# EAGLE design Interdigitated (EAGLE 9.6.2)
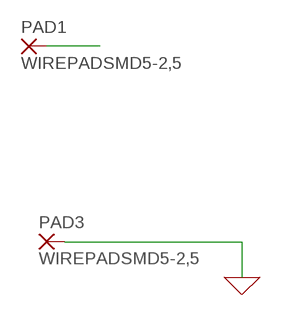
[diagram p0: schematic, sheet 1]

## Parts
PAD1  WIREPADSMD5-2,5  [5-2,5]
PAD3  WIREPADSMD5-2,5  [5-2,5]

## Nets
0: PAD3.1(P) ; supply symbol labelled GND
N$1: PAD1.1(P)

## Library data of the parts
PAD1 PAD3 = wirepad:WIREPAD: Wire PAD connect wire on PCB

## Board
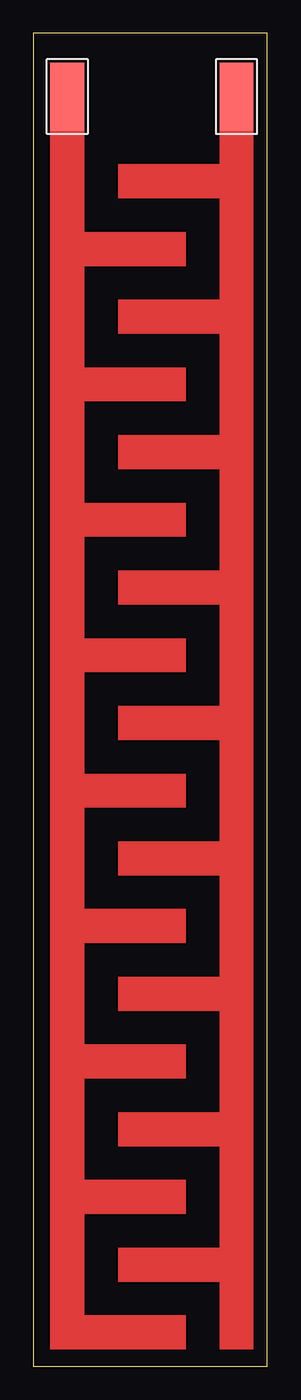
[diagram p1: board, top side]
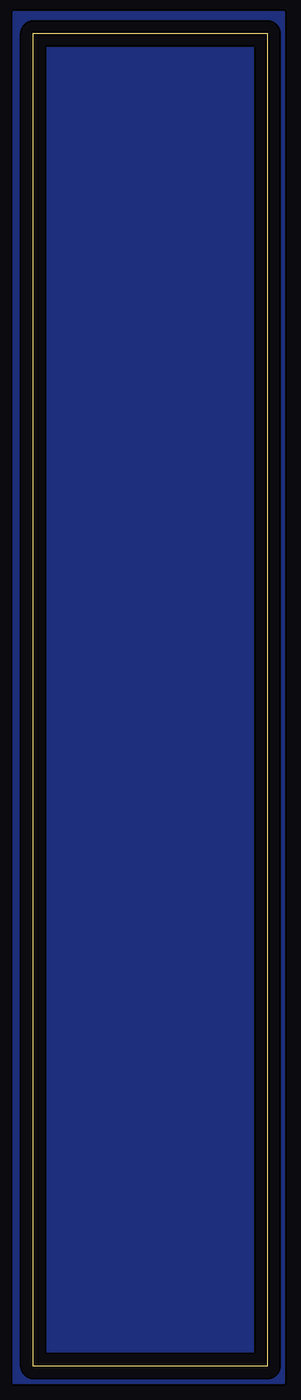
[diagram p2: board, bottom side, seen from below]

Size 17.55 x 100 mm. Coordinates in mm from the lower left corner, seen from the top.
Outline: 0,100 0,0 17.55,0 17.55,100 0,100
Copper layers (1*16): Top 0.035mm / dielectric 1.5mm / Bottom 0.035mm
Design rules "default": minimum track width 6mil, minimum drill 0.35mm, track to track 6mil, track to pad 6mil, pad to pad 6mil, via to via 6mil, smd to smd 6mil, copper to edge 40mil, drill to drill 6mil, minimum pad ring 10mil, minimum via ring 8mil, stop-mask expansion 4mil, vias tented up to drill 0mil, thermal gap 10mil

### Footprints (pad centres in the part's own frame; a part is rotated, then mirrored left to right if it is on the bottom)
5-2,5 = smd 2.54 x 5.08: 1 0,0

### Placement (x,y rotation side)
PAD1  2.54,95.25 0 top
PAD3  15.24,95.25 0 top

### Tracks (layer width: path | path; a pad name or v marks a point on that pad's centre or on a via)
GND
  pour Bottom: -1.27,101.6 19.05,101.6 19.05,-1.27 -1.27,-1.27
(copper drawn outside any net)
  shapes: Top area x20